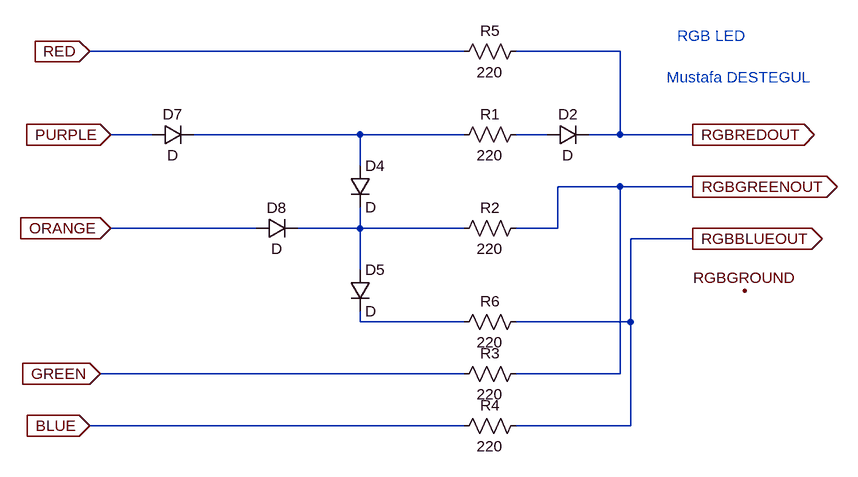
[diagram p0: schematic Draft2.asc]
Draft2.asc, the LTspice schematic file:
Version 4
SHEET 1 1128 680
WIRE 336 32 -240 32
WIRE 576 32 416 32
WIRE -144 160 -208 160
WIRE 176 160 -80 160
WIRE 336 160 176 160
WIRE 464 160 416 160
WIRE 576 160 576 32
WIRE 576 160 528 160
WIRE 688 160 576 160
WIRE 176 208 176 160
WIRE 576 240 480 240
WIRE 688 240 576 240
WIRE 16 304 -208 304
WIRE 176 304 176 272
WIRE 176 304 80 304
WIRE 336 304 176 304
WIRE 480 304 480 240
WIRE 480 304 416 304
WIRE 688 320 592 320
WIRE 176 368 176 304
WIRE 176 448 176 432
WIRE 336 448 176 448
WIRE 592 448 592 320
WIRE 592 448 416 448
WIRE 336 528 -224 528
WIRE 576 528 576 240
WIRE 576 528 416 528
WIRE 336 608 -240 608
WIRE 592 608 592 448
WIRE 592 608 416 608
FLAG -240 32 RED
IOPIN -240 32 In
FLAG -224 528 GREEN
IOPIN -224 528 In
FLAG -240 608 BLUE
IOPIN -240 608 In
FLAG -208 160 PURPLE
IOPIN -208 160 In
FLAG -208 304 ORANGE
IOPIN -208 304 In
FLAG 688 160 RGBREDOUT
IOPIN 688 160 Out
FLAG 688 240 RGBGREENOUT
IOPIN 688 240 Out
FLAG 688 320 RGBBLUEOUT
IOPIN 688 320 Out
FLAG 768 400 RGBGROUND
SYMBOL diode 160 208 R0
SYMATTR InstName D4
SYMBOL diode 160 368 R0
SYMATTR InstName D5
SYMBOL res 432 144 R90
WINDOW 0 0 56 VBottom 2
WINDOW 3 32 56 VTop 2
SYMATTR InstName R1
SYMATTR Value 220
SYMBOL res 432 288 R90
WINDOW 0 0 56 VBottom 2
WINDOW 3 32 56 VTop 2
SYMATTR InstName R2
SYMATTR Value 220
SYMBOL res 432 512 R90
WINDOW 0 0 56 VBottom 2
WINDOW 3 32 56 VTop 2
SYMATTR InstName R3
SYMATTR Value 220
SYMBOL res 432 592 R90
WINDOW 0 0 56 VBottom 2
WINDOW 3 32 56 VTop 2
SYMATTR InstName R4
SYMATTR Value 220
SYMBOL diode 464 176 R270
WINDOW 0 32 32 VTop 2
WINDOW 3 0 32 VBottom 2
SYMATTR InstName D2
SYMBOL diode -144 176 R270
WINDOW 0 32 32 VTop 2
WINDOW 3 0 32 VBottom 2
SYMATTR InstName D7
SYMBOL diode 16 320 R270
WINDOW 0 32 32 VTop 2
WINDOW 3 0 32 VBottom 2
SYMATTR InstName D8
SYMBOL res 432 432 R90
WINDOW 0 0 56 VBottom 2
WINDOW 3 32 56 VTop 2
SYMATTR InstName R6
SYMATTR Value 220
SYMBOL res 432 16 R90
WINDOW 0 0 56 VBottom 2
WINDOW 3 32 56 VTop 2
SYMATTR InstName R5
SYMATTR Value 220
TEXT 664 8 Left 2 ;RGB LED
TEXT 648 72 Left 2 ;Mustafa DESTEGUL

The netlist it stands for:
* Draft2.asc
D4 N001 N003 D
D5 N003 N004 D
R1 N002 N001 220
R2 RGBGREENOUT N003 220
R3 RGBGREENOUT GREEN 220
R4 RGBBLUEOUT BLUE 220
D2 N002 RGBREDOUT D
D7 PURPLE N001 D
D8 ORANGE N003 D
R6 RGBBLUEOUT N004 220
R5 RGBREDOUT RED 220
.model D D
.lib standard.dio
* RGB LED
* Mustafa DESTEGUL
.backanno
.end